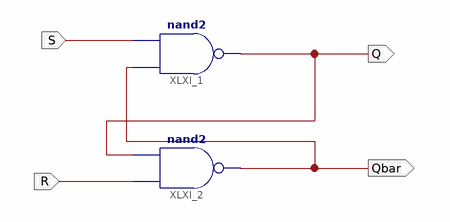
[diagram p0: schematic sheet 1]
// Xilinx ISE schematic SR_LATCH.sch (artix7) as structural Verilog: 2 symbols, 4 ports
module SR_LATCH (
  input  S,
  input  R,
  output Q,
  output Qbar
);

  nand XLXI_1 (Q, Qbar, S);
  nand XLXI_2 (Qbar, R, Q);
endmodule
